# EAGLE design DCO with cv (EAGLE 6.5.0)
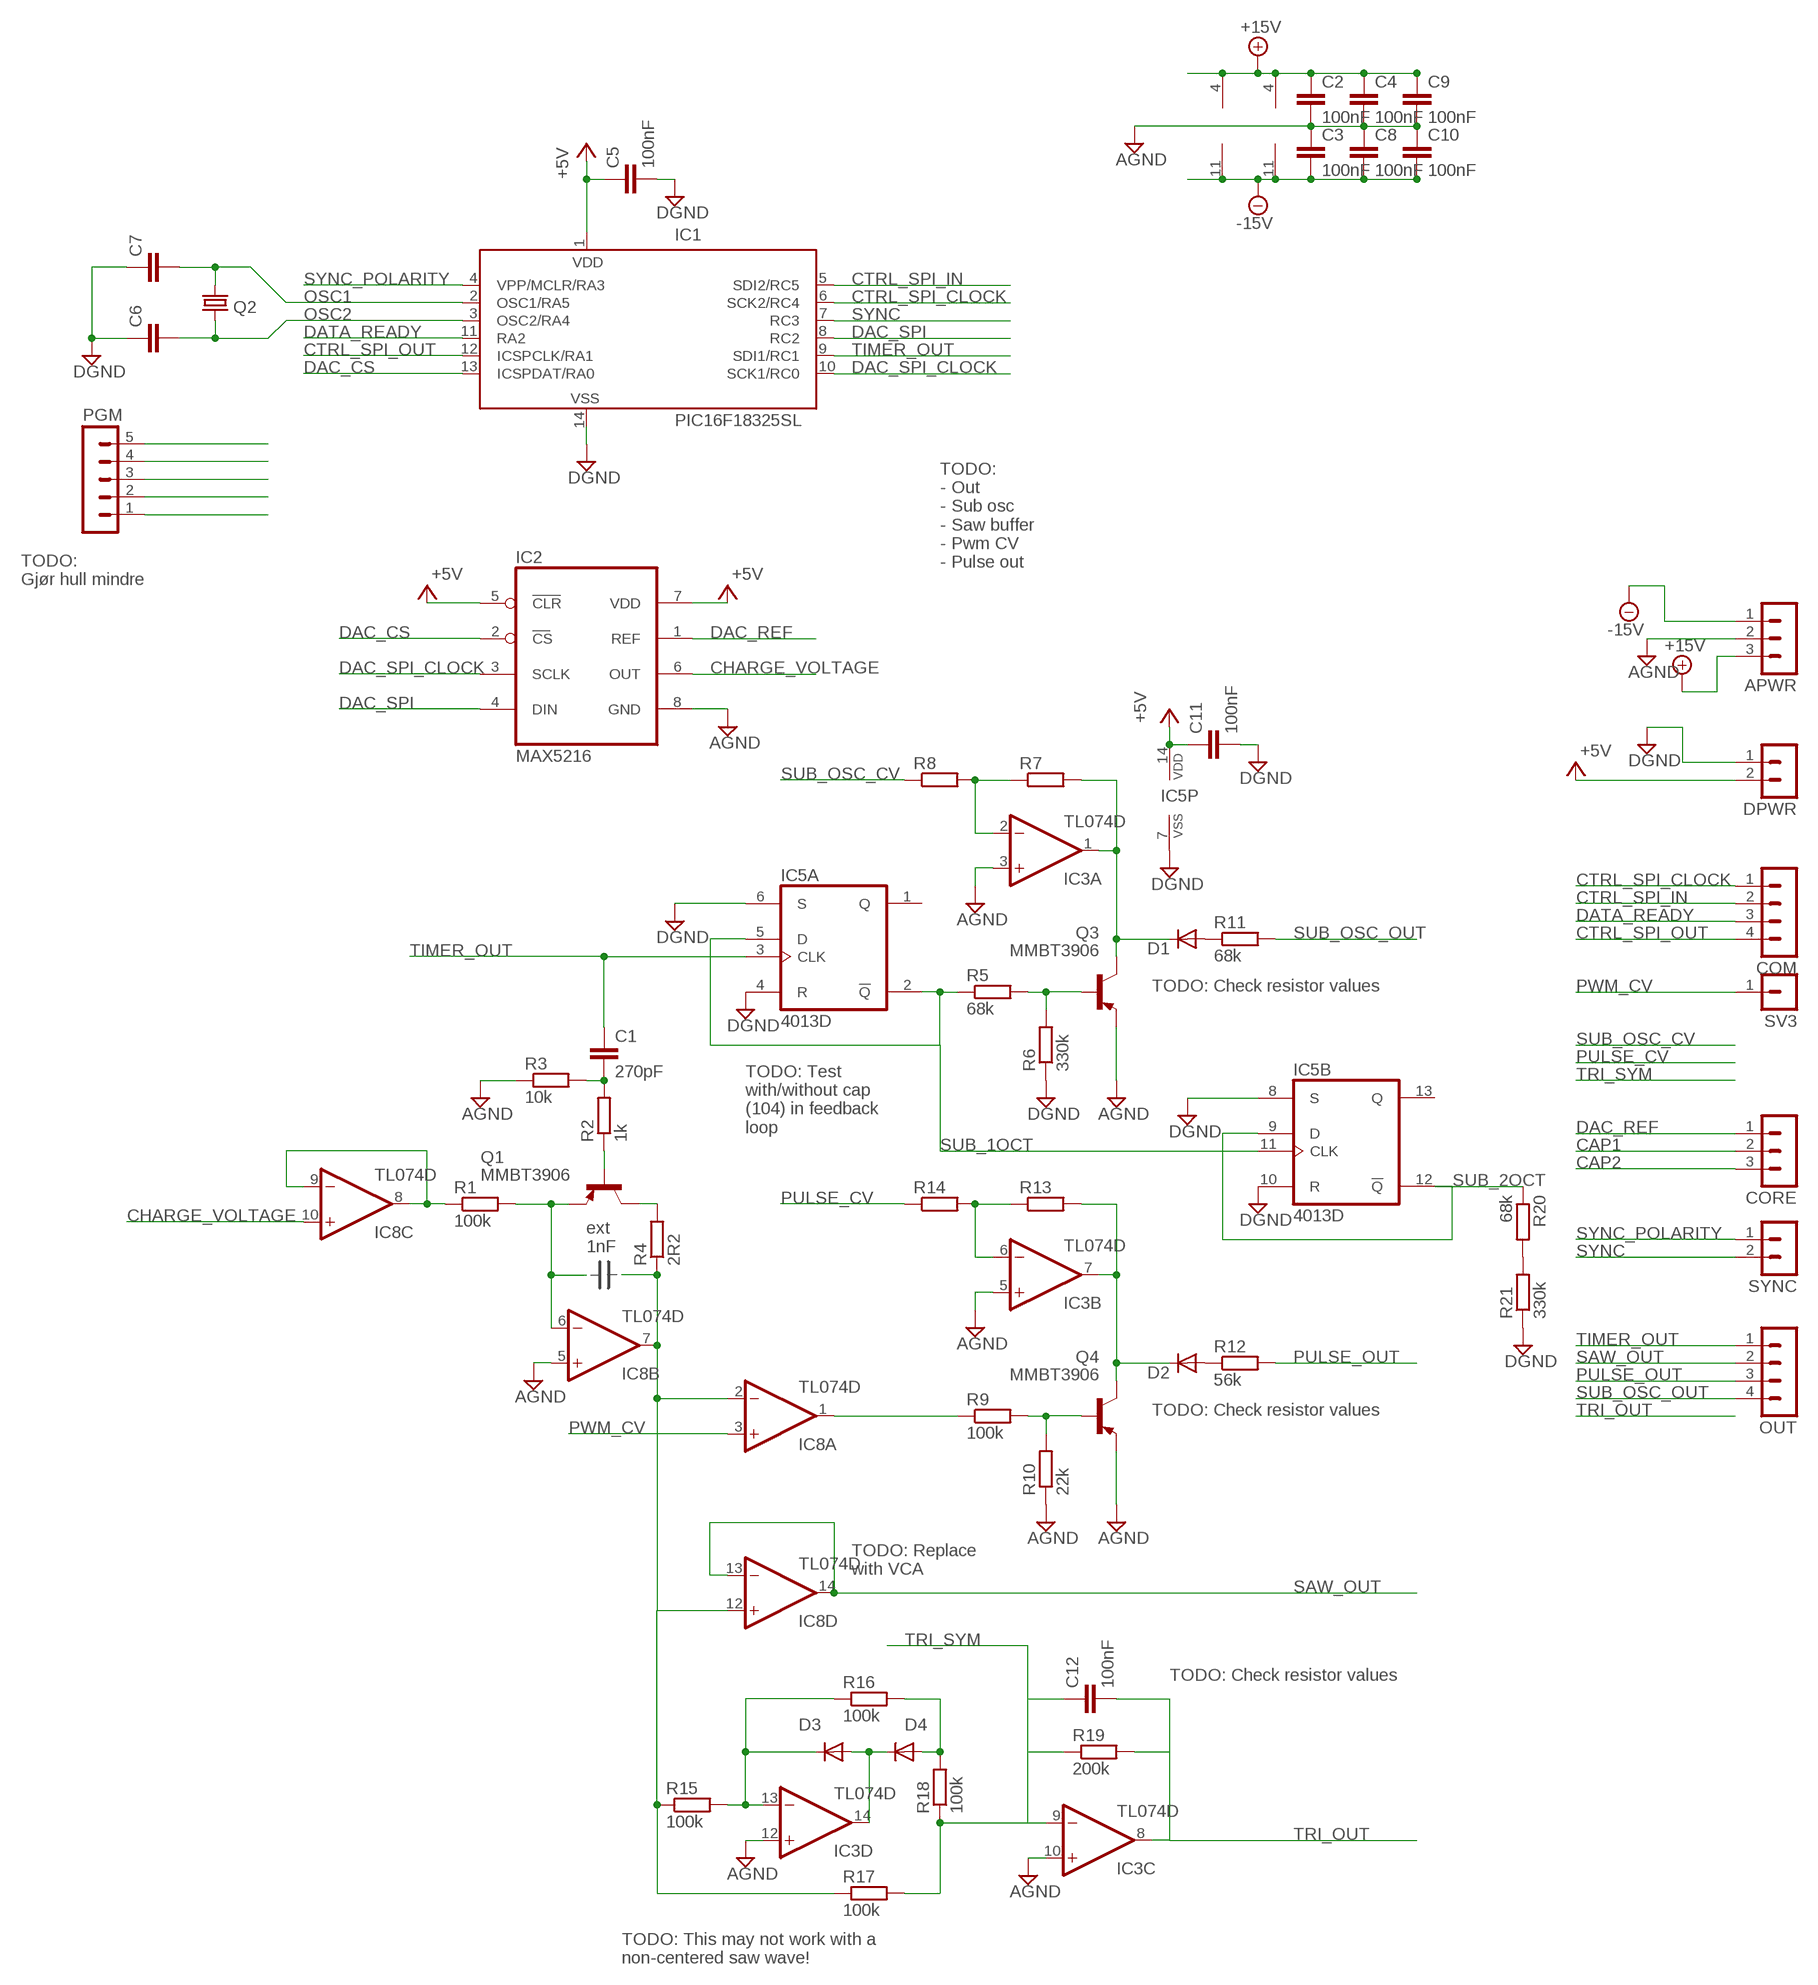
[diagram p0: schematic, sheet 1]

## Parts
APWR  MA03-1J  [MA03-1J]
C1  270pF  C-EUC0805  [C0805]
C2  100nF  C-EUC0805  [C0805]
C3  100nF  C-EUC0805  [C0805]
C4  100nF  C-EUC0805  [C0805]
C5  100nF  C-EUC0805  [C0805]
C6  C-EUC0805  [C0805]
C7  C-EUC0805  [C0805]
C8  100nF  C-EUC0805  [C0805]
C9  100nF  C-EUC0805  [C0805]
C10  100nF  C-EUC0805  [C0805]
C11  100nF  C-EUC0805  [C0805]
C12  100nF  C-EUC0805  [C0805]
COM  MA04-1J  [MA04-1J]
CORE  MA03-1J  [MA03-1J]
D1  DIODE-SOD80C  [SOD80C]
D2  DIODE-SOD80C  [SOD80C]
D3  DIODE-SOD80C  [SOD80C]
D4  DIODE-SOD80C  [SOD80C]
DPWR  MA02-1J  [MA02-1J]
IC1  PIC16F18325SL  [SO14J]
IC2  MAX5216  [UMAX8J]
IC3  TL074D  [SO14]
IC5  4013D  [SO14J]
IC8  TL074D  [SO14]
OUT  MA04-1J  [MA04-1J]
PGM  MA05-1J  [MA05-1J]
Q1  MMBT3906  MMBT3906LT1SMD  [SOT23-BEC]
Q2  CRYSTALHC49S  [HC49/S]
Q3  MMBT3906  MMBT3906LT1SMD  [SOT23-BEC]
Q4  MMBT3906  MMBT3906LT1SMD  [SOT23-BEC]
R1  100k  R-EU_R0805  [R0805]
R2  1k  R-EU_R0805  [R0805]
R3  10k  R-EU_R0805  [R0805]
R4  2R2  R-EU_R0805  [R0805]
R5  68k  R-EU_R0805  [R0805]
R6  330k  R-EU_R0805  [R0805]
R7  R-EU_R0805  [R0805]
R8  R-EU_R0805  [R0805]
R9  100k  R-EU_R0805  [R0805]
R10  22k  R-EU_R0805  [R0805]
R11  68k  R-EU_R0805  [R0805]
R12  56k  R-EU_R0805  [R0805]
R13  R-EU_R0805  [R0805]
R14  R-EU_R0805  [R0805]
R15  100k  R-EU_R0805  [R0805]
R16  100k  R-EU_R0805  [R0805]
R17  100k  R-EU_R0805  [R0805]
R18  100k  R-EU_R0805  [R0805]
R19  200k  R-EU_R0805  [R0805]
R20  68k  R-EU_R0805  [R0805]
R21  330k  R-EU_R0805  [R0805]
SV3  MA01-1J  [MA01-1J]
SYNC  MA02-1J  [MA02-1J]

## Nets
+5V: C5.1 C11.1 DPWR.2 IC1.1(VDD) IC2.5(CLR) IC2.7(VDD) IC5.14(P:VDD)
+15V: APWR.3 C2.1 IC3.4(P:V+) IC8.4(P:V+)
+15V1: C4.1
+15V2: C9.1
-15V: APWR.1 C3.2 IC3.11(P:V-) IC8.11(P:V-)
-15V1: C8.2
-15V2: C10.2
AGND: APWR.2 C2.2 C3.1 C4.2 C8.1 C9.2 C10.1 IC2.8(GND) IC3.3(A:+IN) IC3.5(B:+IN) IC3.10(C:+IN) IC3.12(D:+IN) IC8.5(B:+IN) Q3.E Q4.E R3.1 R10.1
CAP1: CORE.2 IC8.6(B:-IN) Q1.E R1.2
CAP2: CORE.3 IC8.2(A:-IN) IC8.7(B:OUT) IC8.12(D:+IN) R4.1 R15.1 R17.1
CHARGE_VOLTAGE: IC2.6(OUT) IC8.10(C:+IN)
CTRL_SPI_CLOCK: COM.1 IC1.6(SCK2/RC4)
CTRL_SPI_IN: COM.2 IC1.5(SDI2/RC5)
CTRL_SPI_OUT: COM.4 IC1.12(ICSPCLK/RA1)
DAC_CS: IC1.13(ICSPDAT/RA0) IC2.2(CS)
DAC_REF: CORE.1 IC2.1(REF)
DAC_SPI: IC1.8(RC2) IC2.4(DIN)
DAC_SPI_CLOCK: IC1.10(SCK1/RC0) IC2.3(SCLK)
DATA_READY: COM.3 IC1.11(RA2)
DGND: C5.2 C6.1 C7.1 C11.2 DPWR.1 IC1.14(VSS) IC5.4(A:R) IC5.6(A:S) IC5.7(P:VSS) IC5.8(B:S) IC5.10(B:R) R6.1 R21.1
N$1: R20.2 R21.2
N$2: Q1.B R2.1
N$3: Q1.C R4.2
N$4: C1.2 R2.2 R3.2
N$5: PGM.1
N$6: PGM.2
N$7: PGM.3
N$8: PGM.4
N$9: PGM.5
N$10: IC8.8(C:OUT) IC8.9(C:-IN) R1.1
N$11: Q3.B R5.2 R6.2
N$12: D1.C IC3.1(A:OUT) Q3.C R7.2
N$13: IC8.1(A:OUT) R9.1
N$14: Q4.B R9.2 R10.2
N$15: IC3.2(A:-IN) R7.1 R8.2
N$16: D2.C IC3.7(B:OUT) Q4.C R13.2
N$17: D1.A R11.1
N$18: D2.A R12.1
N$19: D3.C IC3.13(D:-IN) R15.2 R16.1
N$20: IC3.6(B:-IN) R13.1 R14.2
N$23: D3.A D4.C IC3.14(D:OUT)
N$24: D4.A R16.2 R18.2
OSC1: C7.2 IC1.2(OSC1/RA5) Q2.2
OSC2: C6.2 IC1.3(OSC2/RA4) Q2.1
PULSE_CV: R14.1
PULSE_OUT: OUT.3 R12.2
PWM_CV: IC8.3(A:+IN) SV3.1
SAW_OUT: IC8.13(D:-IN) IC8.14(D:OUT) OUT.2
SUB_1OCT: IC5.2(A:!Q) IC5.5(A:D) IC5.11(B:CLK) R5.1
SUB_2OCT: IC5.9(B:D) IC5.12(B:!Q) R20.1
SUB_OSC_CV: R8.1
SUB_OSC_OUT: OUT.4 R11.2
SYNC: IC1.7(RC3) SYNC.2
SYNC_POLARITY: IC1.4(VPP/MCLR/RA3) SYNC.1
TIMER_OUT: C1.1 IC1.9(SDI1/RC1) IC5.3(A:CLK) OUT.1
TRI_OUT: C12.2 IC3.8(C:OUT) R19.2
TRI_SYM: C12.1 IC3.9(C:-IN) R17.2 R18.1 R19.1
Unconnected: IC5.1(A:Q) IC5.13(B:Q)

## Notes on the sheet
- TODO: 
  - Out
  - Sub osc
  - Saw buffer
  - Pwm CV
  - Pulse out
- TODO: 
  Gjør hull mindre
- TODO: Check resistor values
- TODO: Test
  with/without cap
  (104) in feedback
  loop
- ext
  1nF
- TODO: Check resistor values
- TODO: Replace
  with VCA
- TODO: Check resistor values
- TODO: This may not work with a 
  non-centered saw wave!

## Library data of the parts
APWR CORE = joakim:MA03-1J: PIN HEADER; OC_FARNELL: unknown; OC_NEWARK: unknown
C1-C12 = resistor:C-EU: CAPACITOR, European symbol
COM OUT = joakim:MA04-1J: PIN HEADER; OC_FARNELL: unknown; OC_NEWARK: unknown
D1-D4 = diode:DIODE-: DIODE
DPWR SYNC = joakim:MA02-1J
IC1 = joakim:PIC16F18325: 14-Pin, Flash-Based 8-Bit CMOS Microcontroller; MF: MICROCHIP; MPN: PIC16F676-I/SL; OC_FARNELL: 9760520; OC_NEWARK: 92C4557
IC2 = joakim:MAX5216: DIGITAL/ANALOG CONVERTER Covers MAX5214 (14 bit), MAX5216 (16 bit)
IC3 IC8 = linear:TL074: OP AMP
IC5 = joakim:4013: Dual D FLIP FLOP, set/reset
PGM = joakim:MA05-1J: PIN HEADER; OC_FARNELL: unknown; OC_NEWARK: unknown
Q1 Q3 Q4 = transistor-pnp:MMBT3906*: PNP Transistror
Q2 = crystal:CRYSTAL: CRYSTAL; OC_FARNELL: 1667008; OC_NEWARK: unknown
R1-R21 = resistor:R-EU_: RESISTOR, European symbol
SV3 = joakim:MA01-1J: PIN HEADER

## Board
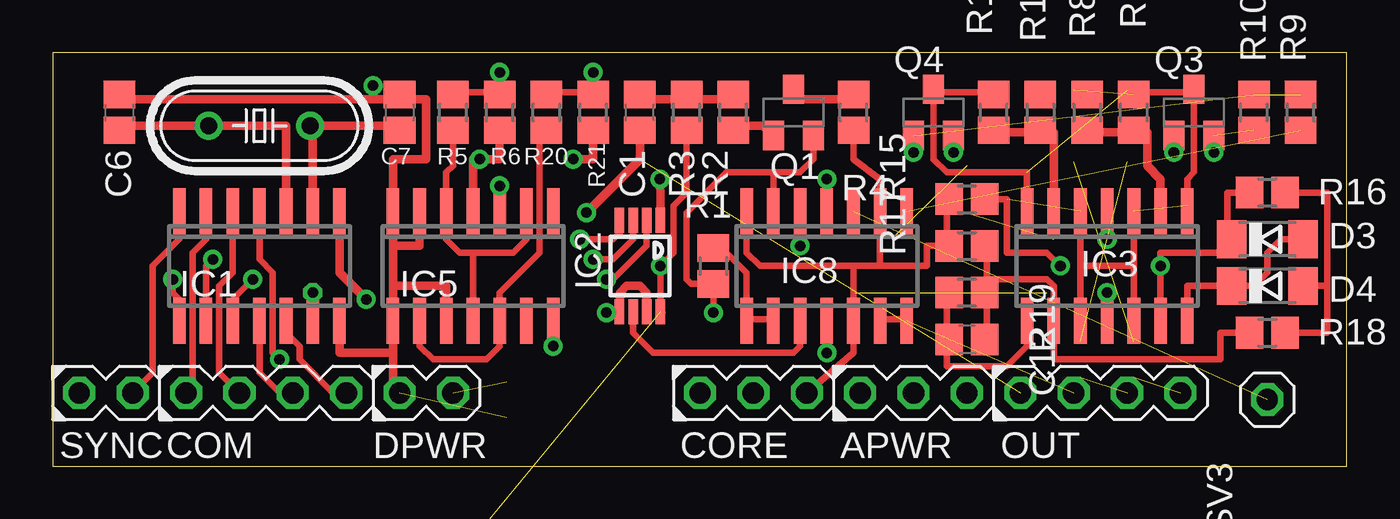
[diagram p1: board, top side]
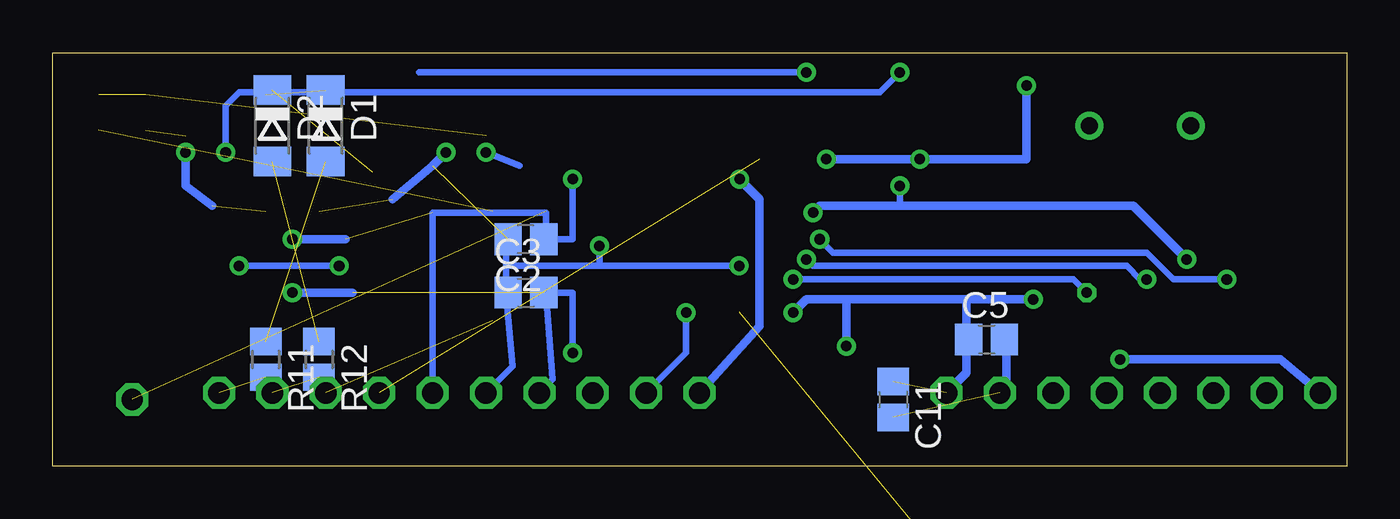
[diagram p2: board, bottom side, seen from below]

Size 61.58 x 19.67 mm. Coordinates in mm from the lower left corner, seen from the top.
Outline: 0,0 61.58,0 61.58,19.67 0,19.67 0,0
Copper layers (1*16): Top 0.035mm / dielectric 1.5mm / Bottom 0.035mm
Design rules "default": minimum track width 10mil, minimum drill 24mil, track to track 8mil, track to pad 8mil, pad to pad 8mil, via to via 8mil, smd to smd 8mil, copper to edge 40mil, drill to drill 8mil, minimum pad ring 10mil, minimum via ring 8mil, stop-mask expansion 4mil, vias tented up to drill 0mil, thermal gap 10mil

### Footprints (pad centres in the part's own frame; a part is rotated, then mirrored left to right if it is on the bottom)
MA03-1J = drill 1.016 octagon: 1 -2.54,0; 2 0,0; 3 2.54,0
C0805 = smd 1.3 x 1.5: 1 -0.85,0; 2 0.85,0
MA04-1J = drill 1.016 octagon: 1 -3.81,0; 2 -1.27,0; 3 1.27,0; 4 3.81,0
SOD80C = smd 1.4 x 1.8: A 1.7,0; C -1.7,0
MA02-1J = drill 1.016 octagon: 1 -2.54,0; 2 0,0
SO14J = smd 0.6 x 2.2: 1 -3.81,-2.6; 2 -2.54,-2.6; 3 -1.27,-2.6; 4 0,-2.6; 5 1.27,-2.6; 6 2.54,-2.6; 7 3.81,-2.6; 8 3.81,2.6; 9 2.54,2.6; 10 1.27,2.6; 11 0,2.6; 12 -1.27,2.6; 13 -2.54,2.6; 14 -3.81,2.6
UMAX8J = smd 0.45 x 1.2: 1 -0.975,-2.175; 2 -0.325,-2.175; 3 0.325,-2.175; 4 0.975,-2.175; 5 0.975,2.175; 6 0.325,2.175; 7 -0.325,2.175; 8 -0.975,2.175
SO14 = smd 0.6 x 2.2: 1 -3.81,-2.6; 2 -2.54,-2.6; 3 -1.27,-2.6; 4 0,-2.6; 5 1.27,-2.6; 6 2.54,-2.6; 7 3.81,-2.6; 8 3.81,2.6; 9 2.54,2.6; 10 1.27,2.6; 11 0,2.6; 12 -1.27,2.6; 13 -2.54,2.6; 14 -3.81,2.6
MA05-1J = drill 1.016 octagon: 1 -5.08,0; 2 -2.54,0; 3 0,0; 4 2.54,0; 5 5.08,0
SOT23-BEC = smd 1 x 1.4: B -0.95,-1.1; C 0,1.1; E 0.95,-1.1
HC49/S = drill 0.813: 1 -2.413,0; 2 2.413,0
R0805 = smd 1.3 x 1.5: 1 -0.85,0; 2 0.85,0
MA01-1J = drill 1.016 octagon: 1 0,0

### Placement (x,y rotation side)
APWR  40.96,3.49 0 top
C1  27.94,16.83 90 top
C2  39.05,10.79 180 bottom
C3  39.05,8.26 0 bottom
C4  -56.83,-95.57 0 top  (outside the outline)
C5  17.14,6.03 0 bottom
C6  3.17,16.83 270 top
C7  16.51,16.83 270 top
C8  -56.83,-101.28 0 top  (outside the outline)
C9  -56.83,-107 0 top  (outside the outline)
C10  -56.83,-112.71 0 top  (outside the outline)
C11  21.59,3.17 270 bottom
C12  43.5,6.03 180 top
COM  10.16,3.49 0 top
CORE  33.34,3.49 0 top
D1  48.58,16.19 270 bottom
D2  51.12,16.19 270 bottom
D3  57.78,10.79 0 top
D4  57.78,8.57 0 top
DPWR  19.05,3.49 0 top
IC1  9.84,9.53 180 top
IC2  27.94,9.53 180 top
IC3  50.16,9.53 180 top
IC5  20,9.53 180 top
IC8  36.83,9.53 180 top
OUT  49.85,3.49 0 top
PGM  -34.29,-22.86 0 top  (outside the outline)
Q1  35.24,16.83 0 top
Q2  9.84,16.19 0 top
Q3  54.29,16.83 0 top
Q4  41.91,16.83 0 top
R1  31.43,9.53 270 top
R2  32.38,16.83 90 top
R3  30.16,16.83 90 top
R4  38.1,16.83 90 top
R5  19.05,16.83 90 top
R6  21.27,16.83 90 top
R7  51.44,16.83 90 top
R8  49.21,16.83 270 top
R9  59.37,16.83 90 top
R10  57.15,16.83 90 top
R11  51.44,5.08 270 bottom
R12  48.9,5.08 270 bottom
R13  44.77,16.83 90 top
R14  46.99,16.83 270 top
R15  43.5,12.7 0 top
R16  57.78,13.02 0 top
R17  43.5,10.48 0 top
R18  50k  [R0805]  57.78,6.35 0 top
R19  43.5,8.26 180 top
R20  23.5,16.83 90 top
R21  25.72,16.83 90 top
SV3  57.78,3.17 90 top
SYNC  3.81,3.49 0 top

### Tracks (layer width: path | path; a pad name or v marks a point on that pad's centre or on a via)
+5V  (via drill 0.5)  (1 unrouted)
  Top 0.406: 13.71,12.06 IC1.1 | 13.65,11.43 IC1.1 | IC2.7 28.27,8.25 27.94,8.57 27.3,8.57 26.99,8.26 26.99,7.37 IC2.5 26.92,7.3 v26.35,7.3 | IC5.14 v23.81,5.71 | v14.92,7.94 13.65,9.21 IC1.1
  Bottom 0.406: 18.1,7.94 23.81,7.94 | 23.81,7.94 25.72,7.94 v26.35,7.3 | v23.81,5.71 23.81,7.94 | v14.92,7.94 18.1,7.94 | 18.1,7.94 18.1,6.13 C5.1 | C5.1 18.1,6.03 | DPWR.2 18.1,4.45 18.1,5.93 C5.1
+15V  (via drill 0.5)  (1 unrouted)
  Top 0.305: IC8.4 v36.83,13.65
  Top 0.406: IC3.4 v50.16,10.79
  Bottom 0.305: v36.83,13.65 36.83,10.79 C2.1 38.1,10.9 38.1,12.06 43.5,12.06 APWR.3
  Bottom 0.406: v50.16,10.79 47.62,10.79
-15V  (via drill 0.5)  (1 unrouted)
  Top 0.305: IC8.11 v36.83,5.4
  Top 0.406: IC3.11 v50.16,8.26
  Bottom 0.305: v36.83,5.4 36.83,8.26 C3.2 38.1,8.15 37.78,4.13 APWR.1
  Bottom 0.406: v50.16,8.26 47.31,8.26
AGND  (via drill 0.5)  (8 unrouted)
  Top 0.305: IC8.5 v35.56,10.48 | IC2.8 v28.91,9.53 28.91,9.55 29.53,10.16 29.53,12.38 30.16,13.02 R3.1 | 48.9,9.53 IC3.5 | IC3.3 51.44,9.53 | 51.44,9.53 48.9,9.53 | 51.44,9.53 IC3.12 | IC3.10 48.9,9.53
  Top 0.406: 28.96,7.3 IC2.8 | Q4.E v42.86,14.93 v42.86,14.92 | Q3.E v55.24,14.93 v55.24,14.92
  Bottom 0.305: APWR.2 39.69,4.76 40.01,8.15 C3.1 39.9,8.79 40.01,8.89 40.01,9.53 | 40.01,9.53 40.01,10.69 C2.2 | 40.01,9.53 35.56,9.53 | 35.56,9.53 v28.91,9.53 | v35.56,10.48 35.56,9.53
  Bottom 0.406: v42.86,14.92 43.5,14.29 45.4,12.7 | v55.24,14.92 55.24,13.34 53.98,12.38
CAP1  (via drill 0.5)
  Top 0.305: IC8.6 34.29,13.97 | 34.29,13.97 35.56,13.97 36.2,14.61 36.2,15.24 35.88,15.41 Q1.E | v31.43,7.3 R1.2 30.38,8.68 30.16,8.89 30.16,12.06 32.07,13.97 34.29,13.97
  Bottom 0.305: CORE.2 31.43,5.4 v31.43,7.3
CAP2
  Top 0.305: IC8.7 33.02,10.16 33.66,9.53 38.1,9.53 | 38.1,9.53 IC8.12 38.1,5.4 CORE.3 | 39.37,9.53 IC8.2 39.37,13.65 38.1,14.61 R4.1 | 39.37,9.53 38.1,9.53 | R15.1 42.55,12.7 42.55,10.58 R17.1 41.59,10.48 41.59,9.53 39.37,9.53
CHARGE_VOLTAGE
  Top 0.305: IC2.6 27.61,6.36 28.57,5.4 35.24,5.4 35.56,5.71 IC8.10
CTRL_SPI_CLOCK
  Top 0.305: COM.1 6.67,3.81 6.67,10.16 7.3,10.79 IC1.6
CTRL_SPI_IN
  Top 0.305: IC1.5 8.57,9.21 7.94,8.57 7.94,4.45 COM.2
CTRL_SPI_OUT
  Top 0.305: 11.11,6.35 11.75,5.71 11.75,5.08 13.34,3.49 COM.4
  Top 0.406: IC1.12 11.11,6.35
DAC_CS  (via drill 0.5)
  Top 0.305: IC1.13 v12.38,8.26 | v26.35,8.89 26.67,8.89 28.26,10.48 28.26,11.69 IC2.2
  Bottom 0.305: v12.38,8.26 13.02,8.89 v26.35,8.89
DAC_REF  (via drill 0.5)
  Top 0.406: IC2.1 28.91,12.68 v28.89,13.65
  Bottom 0.406: CORE.1 27.94,6.67 27.94,12.7 v28.89,13.65
DAC_SPI  (via drill 0.5)
  Top 0.305: v25.08,10.79 26.67,10.79 26.99,11.11 26.99,11.68 | v5.71,8.89 5.71,8.26 6.03,7.94 IC1.8
  Top 0.406: 26.99,11.68 IC2.4
  Bottom 0.305: v5.71,8.89 8.26,8.89 9.53,10.16 24.45,10.16 v25.08,10.79
DAC_SPI_CLOCK  (via drill 0.5)
  Top 0.305: v25.72,9.84 26.67,9.84 27.62,10.79 IC2.3 | v9.53,8.89 8.57,7.94 IC1.10
  Bottom 0.305: v9.53,8.89 9.84,8.89 10.48,9.53 25.4,9.53 v25.72,9.84
DATA_READY
  Top 0.305: IC1.11 9.84,4.45 10.79,3.49 COM.3
DGND  (via drill 0.5)  (1 unrouted)
  Top 0.305: 16.13,6.99 IC5.8
  Top 0.406: C6.1 3.17,17.46 16.73,17.46 | IC1.14 13.71,6.99 13.71,6.41 13.65,6.35 13.65,5.4 16.19,5.4 | v15.24,18.1 15.24,17.46 16.51,17.46 C7.1 16.73,17.46 | 16.19,8.57 IC5.8 16.19,5.4 | 16.19,8.57 16.19,10.48 | 16.19,10.48 IC5.7 16.19,14.61 17.78,14.61 17.78,17.46 16.73,17.46 | 16.19,10.48 17.46,10.48 IC5.6 | IC5.10 18.73,8.57 16.19,8.57 | 16.19,5.4 16.19,3.81 DPWR.1 | R21.1 25.72,14.61 v24.77,14.61 | R6.1 21.27,14.61 v20.32,14.61 20,14.61 IC5.4
  Bottom 0.406: DPWR.1 16.19,3.81 16.19,5.93 C5.2 | v24.77,14.61 v20.32,14.61 15.24,14.61 v15.24,18.1
N$1  (via drill 0.5)
  Top 0.305: 25.61,17.78 25.72,17.78 v25.72,18.73 | R20.2 23.5,17.78 25.61,17.78 | 25.61,17.78 R21.2
  Bottom 0.305: v25.72,18.73 44.13,18.73
N$2
  Top 0.406: R2.1 32.38,16.19 33.83,16.19 Q1.B
N$3
  Top 0.406: R4.2 38.1,17.46 35.24,17.46 Q1.C
N$4
  Top 0.406: 28.26,17.78 C1.2 28.26,17.46 30.58,17.46 R3.2 30.8,17.46 32.17,17.46 R2.2
N$10
  Top 0.305: IC8.9 34.23,6.99 33.02,6.99 IC8.8 33.02,9.21 31.85,10.38 R1.1
N$11  (via drill 0.5)
  Top 0.305: 21.17,17.78 21.27,17.78 v21.27,18.73 | R5.2 19.05,17.78 21.17,17.78 | 21.17,17.78 R6.2 | Q3.B v53.34,14.93 v53.34,14.92
  Bottom 0.305: v21.27,18.73 22.23,17.78 52.7,17.78 53.34,17.14 v53.34,14.92
N$12  (1 unrouted)
  Top 0.305: IC3.1 53.98,13.65 54.29,13.97 Q3.C 54.15,17.78 51.44,17.78 R7.2
N$13  (1 unrouted)
N$14  (via drill 0.5)  (2 unrouted)
  Top 0.305: Q4.B v40.96,14.93 v40.96,14.92
  Bottom 0.305: v40.96,14.92 39.37,14.29
N$15
  Top 0.406: IC3.2 52.7,13.65 52.07,14.29 52.07,15.88 51.33,15.88 R7.1 51.44,15.88 49.31,15.88 R8.2
N$16  (1 unrouted)
  Top 0.305: 41.91,17.78 41.91,14.61 42.55,13.97 46.35,13.97 IC3.7 | 41.91,17.78 44.66,17.78 R13.2 | Q4.C 41.91,17.78
N$17  (1 unrouted)
N$18  (1 unrouted)
N$19  (via drill 0.5)
  Top 0.305: IC3.13 v52.7,9.53 52.7,10.16 55.88,10.16 56.09,10.37 D3.C 55.88,11 55.88,13.02 R16.1 | R15.2 45.4,12.7 45.4,10.16 47.31,10.16 v47.94,9.53
  Bottom 0.305: v47.94,9.53 v52.7,9.53
N$20
  Top 0.305: R13.1 44.77,15.88
  Top 0.406: IC3.6 47.62,15.88 46.89,15.88 | 44.77,15.88 46.89,15.88 | 46.89,15.88 R14.2
N$23
  Top 0.305: D3.A 58.42,10.79 57.78,10.16 57.78,9.21 57.15,8.57 D4.C 53.98,8.57 IC3.14
N$24
  Top 0.305: 60.64,8.57 60.64,13.02 R16.2 | D4.A 60.64,8.57 | 60.64,8.57 60.64,6.35 R18.2
OSC1
  Top 0.406: IC1.2 12.38,16.19 Q2.2 16.41,16.19 C7.2
OSC2
  Top 0.406: IC1.3 11.11,16.19 Q2.1 3.28,16.19 C6.2
PULSE_OUT  (1 unrouted)
PWM_CV  (1 unrouted)
SAW_OUT  (1 unrouted)
  Top 0.305: IC8.13 39.37,6.99 40.58,6.99 IC8.14
SUB_1OCT
  Top 0.305: IC5.11 20,10.16 | 20,10.16 21.91,10.16 22.54,10.79 IC5.2 | R5.1 19.05,14.29 18.73,13.97 IC5.5 18.73,10.79 19.37,10.16 20,10.16
SUB_2OCT
  Top 0.305: IC5.9 17.46,5.71 18.1,5.08 20.64,5.08 21.27,5.71 IC5.12 21.27,8.26 23.18,10.16 23.18,15.66 R20.1
SUB_OSC_OUT  (1 unrouted)
SYNC
  Top 0.305: 6.03,12.06 6.03,10.79 4.76,9.53 4.76,4.45 SYNC.2
  Top 0.406: 6.03,12.06 IC1.7
SYNC_POLARITY  (via drill 0.5)
  Top 0.305: v10.79,5.08 10.48,5.4 10.48,9.21 9.84,9.84 IC1.4
  Bottom 0.406: v10.79,5.08 3.17,5.08 SYNC.1
TIMER_OUT  (via drill 0.5)  (1 unrouted)
  Top 0.305: IC5.3 v21.27,13.34 | v7.62,9.84 7.3,9.53 IC1.9
  Top 0.406: v25.4,12.06 27.94,14.61 C1.1
  Bottom 0.305: v21.27,13.34 21.27,12.38
  Bottom 0.406: v7.62,9.84 10.16,12.38 21.27,12.38 25.08,12.38 v25.4,12.06
TRI_OUT
  Top 0.305: 46.35,6.99 IC3.8 46.35,5.71 45.4,4.76 42.55,4.76 42.55,5.93 | 42.55,5.93 42.55,8.15 R19.2 | 42.55,5.93 C12.2
TRI_SYM
  Top 0.305: R18.1 55.56,6.35 55.56,5.08 47.62,5.08 IC3.9 47.62,8.57 47.31,8.89 44.45,8.89 | C12.1 44.45,6.03 44.45,8.36 | R17.2 44.45,10.38 44.45,8.89 | 44.45,8.89 44.45,8.36 | 44.45,8.36 R19.1